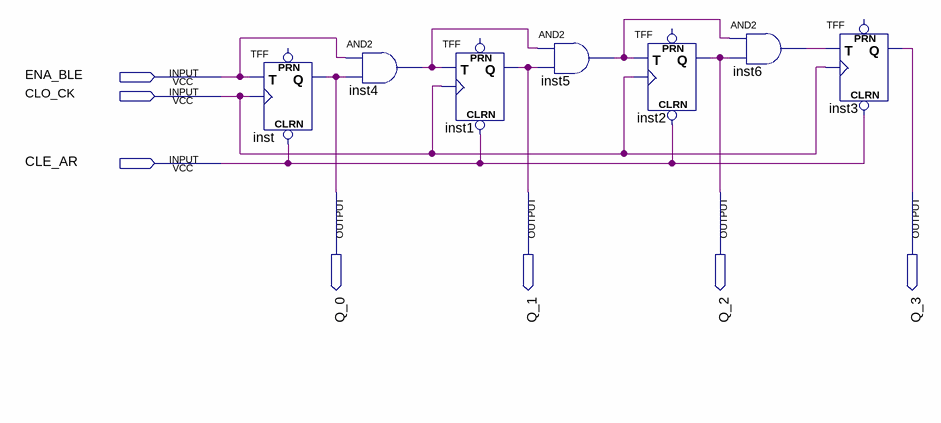
[diagram p0: schematic sheet]
// Quartus schematic contador4b.bdf as structural Verilog: 7 symbols, 7 pins
module contador4b (
  input  ENA_BLE,
  input  CLO_CK,
  input  CLE_AR,
  output Q_0,
  output Q_1,
  output Q_2,
  output Q_3
);

  wire inst4_out, inst5_out, inst6_out;

  TFF inst (.CLRN(CLE_AR), .T(ENA_BLE), .CLK(CLO_CK), .Q(Q_0));  // open: PRN
  and inst4 (inst4_out, ENA_BLE, Q_0);
  TFF inst1 (.CLRN(CLE_AR), .T(inst4_out), .CLK(CLO_CK), .Q(Q_1));  // open: PRN
  and inst5 (inst5_out, inst4_out, Q_1);
  TFF inst2 (.CLRN(CLE_AR), .T(inst5_out), .CLK(CLO_CK), .Q(Q_2));  // open: PRN
  and inst6 (inst6_out, inst5_out, Q_2);
  TFF inst3 (.CLRN(CLE_AR), .T(inst6_out), .CLK(CLO_CK), .Q(Q_3));  // open: PRN
endmodule
